# Altium schematic sheet CH340G_PTT.SchDoc
size A3; SheetNumber: 1; SheetTotal: 1
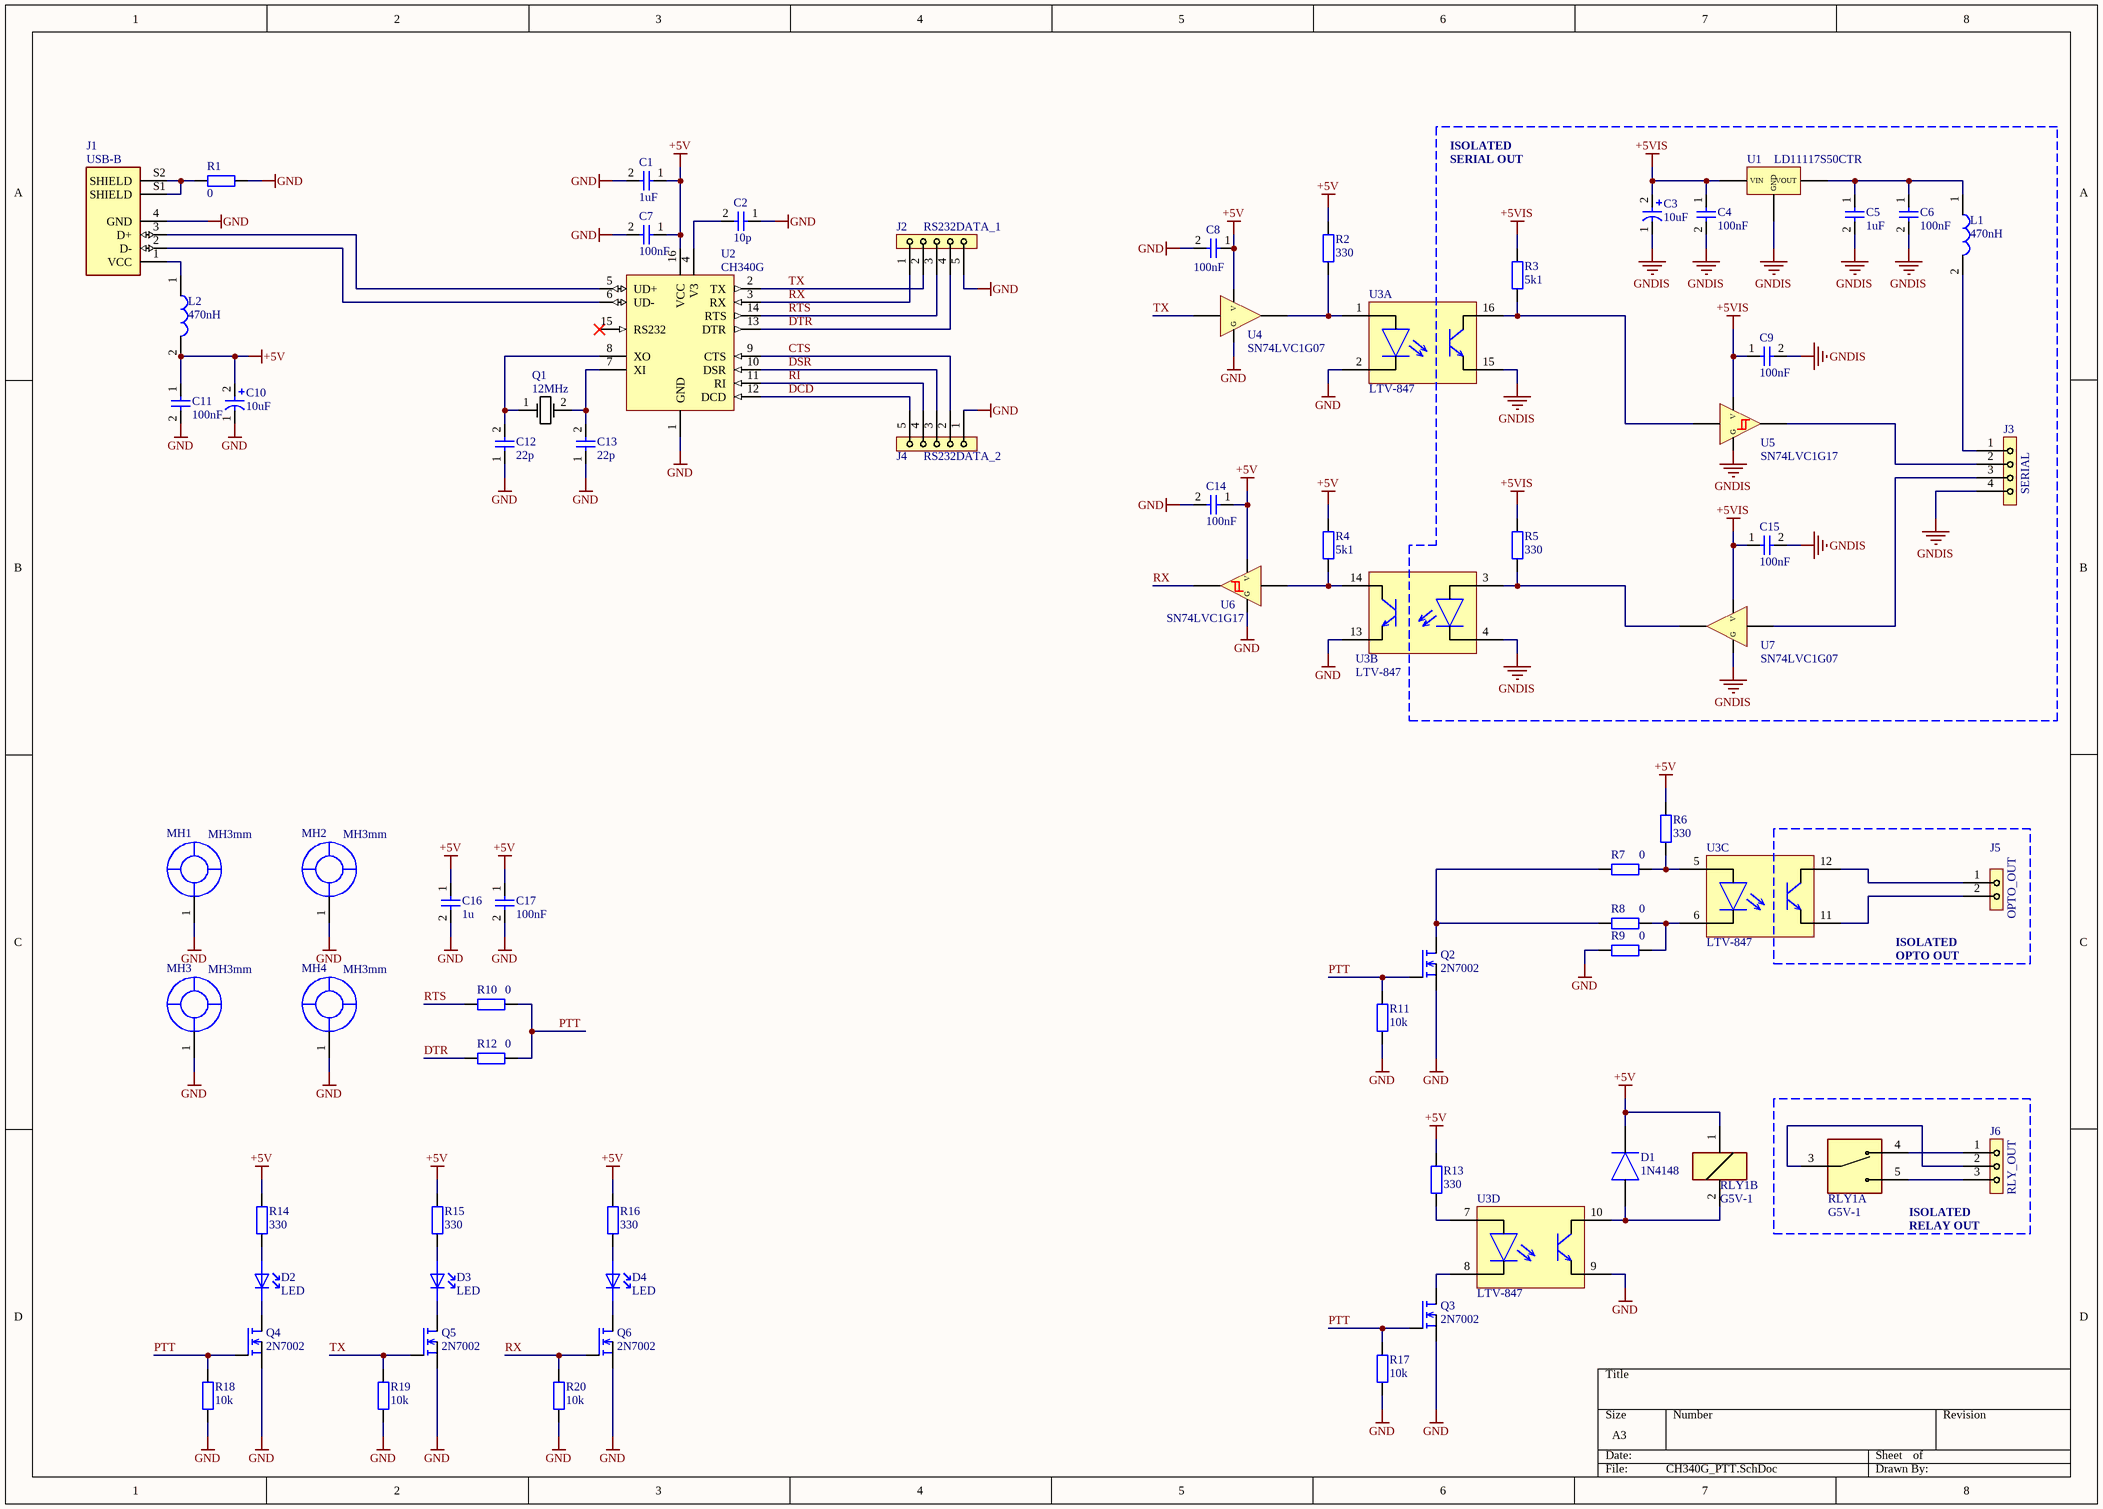
[diagram p0: CH340G_PTT.SchDoc]

## Parts
C1  1uF  [FP-1206-L_3_2_0_2-W_1_6_0-IPC_B]
C2  10p  [FP-1206-L_3_2_0_2-W_1_6_0-IPC_B]
C3  10uF  [CAP_SMD_6.3x7.7mm]
C4  100nF  [FP-1206-L_3_2_0_2-W_1_6_0-IPC_B]
C5  1uF  [FP-1206-L_3_2_0_2-W_1_6_0-IPC_B]
C6  100nF  [FP-1206-L_3_2_0_2-W_1_6_0-IPC_B]
C7  100nF  [FP-1206-L_3_2_0_2-W_1_6_0-IPC_B]
C8  100nF  [FP-1206-L_3_2_0_2-W_1_6_0-IPC_B]
C9  100nF  [FP-1206-L_3_2_0_2-W_1_6_0-IPC_B]
C10  10uF  [CAP_SMD_6.3x7.7mm]
C11  100nF  [FP-1206-L_3_2_0_2-W_1_6_0-IPC_B]
C12  22p  [FP-1206-L_3_2_0_2-W_1_6_0-IPC_B]
C13  22p  [FP-1206-L_3_2_0_2-W_1_6_0-IPC_B]
C14  100nF  [FP-1206-L_3_2_0_2-W_1_6_0-IPC_B]
C15  100nF  [FP-1206-L_3_2_0_2-W_1_6_0-IPC_B]
C16  1u  [FP-1206-L_3_2_0_2-W_1_6_0-IPC_B]
C17  100nF  [FP-1206-L_3_2_0_2-W_1_6_0-IPC_B]
D1  1N4148  [SOD80C]
D2  LED  [LED_3mm]
D3  LED  [LED_3mm]
D4  LED  [LED_3mm]
J1  USB-B  [USB-B]
J2  RS232DATA_1  [PIN_HEADER_1L_5P]
J3  SERIAL  [PIN_HEADER_1L_4P]
J4  RS232DATA_2  [PIN_HEADER_1L_5P]
J5  OPTO_OUT  [PIN_HEADER_1L_2P]
J6  RLY_OUT  [PIN_HEADER_1L_3P]
L1  470nH  [INDC2012X105N]
L2  470nH  [INDC2012X105N]
MH1  MH3mm  [MOUNTING_HOLE_GROUNDED]
MH2  MH3mm  [MOUNTING_HOLE_GROUNDED]
MH3  MH3mm  [MOUNTING_HOLE_GROUNDED]
MH4  MH3mm  [MOUNTING_HOLE_GROUNDED]
Q1  12MHz  [XTAL_SMD]
Q2  2N7002  [SOT23]
Q3  2N7002  [SOT23]
Q4  2N7002  [SOT23]
Q5  2N7002  [SOT23]
Q6  2N7002  [SOT23]
R1  0  [FP-CRCW1206-e3-IPC_B]
R2  Resistance: 330  [FP-CRCW1206-e3-IPC_B]  (hidden comment: Resistor)
R3  Resistance: 5k1  [FP-CRCW1206-e3-IPC_B]  (hidden comment: Resistor)
R4  Resistance: 5k1  [FP-CRCW1206-e3-IPC_B]  (hidden comment: Resistor)
R5  Resistance: 330  [FP-CRCW1206-e3-IPC_B]  (hidden comment: Resistor)
R6  Resistance: 330  [FP-CRCW1206-e3-IPC_B]  (hidden comment: Resistor)
R7  Resistance: 0  [FP-CRCW1206-e3-IPC_B]  (hidden comment: Resistor)
R8  Resistance: 0  [FP-CRCW1206-e3-IPC_B]  (hidden comment: Resistor)
R9  Resistance: 0  [FP-CRCW1206-e3-IPC_B]  (hidden comment: Resistor)
R10  Resistance: 0  [FP-CRCW1206-e3-IPC_B]  (hidden comment: Resistor)
R11  Resistance: 10k  [FP-CRCW1206-e3-IPC_B]  (hidden comment: Resistor)
R12  Resistance: 0  [FP-CRCW1206-e3-IPC_B]  (hidden comment: Resistor)
R13  Resistance: 330  [FP-CRCW1206-e3-IPC_B]  (hidden comment: Resistor)
R14  Resistance: 330  [FP-CRCW1206-e3-IPC_B]  (hidden comment: Resistor)
R15  Resistance: 330  [FP-CRCW1206-e3-IPC_B]  (hidden comment: Resistor)
R16  Resistance: 330  [FP-CRCW1206-e3-IPC_B]  (hidden comment: Resistor)
R17  Resistance: 10k  [FP-CRCW1206-e3-IPC_B]  (hidden comment: Resistor)
R18  Resistance: 10k  [FP-CRCW1206-e3-IPC_B]  (hidden comment: Resistor)
R19  Resistance: 10k  [FP-CRCW1206-e3-IPC_B]  (hidden comment: Resistor)
R20  Resistance: 10k  [FP-CRCW1206-e3-IPC_B]  (hidden comment: Resistor)
RLY1  G5V-1  [OMRON-G5V-1]  (parts A,B of 2)
U1  LD11117S50CTR  [SOT230P700X180-4N]
U2  CH340G  [SOIC16]
U3  LTV-847  [DIP16]  (parts A,B,C,D of 4)
U4  SN74LVC1G07  [SOT95P280X145-5N]
U5  SN74LVC1G17  [SOT95P280X145-5N]
U6  SN74LVC1G17  [SOT95P280X145-5N]
U7  SN74LVC1G07  [SOT95P280X145-5N]

## Nets
+5V: C1.1 C7.1 C8.1 C10.2 C11.1 C14.1 C16.1 C17.1 D1.2(K) L2.2 R2.2 R4.2 R6.2 R13.2 R14.2 R15.2 R16.2 RLY1.1 U2.16(VCC) U4.5(V) U6.5(V)
+5VIS: C3.2 C4.1 C9.1 C15.1 R3.2 R5.1 U1.3(VIN) U5.5(V) U7.5(V)
GND: C1.2 C2.1 C7.2 C8.2 C10.1 C11.2 C12.1 C13.1 C14.2 C16.2 C17.2 J1.4(GND) J2.5 J4.1 MH1.1 MH2.1 MH3.1 MH4.1 Q2.3(S) Q3.3(S) Q4.3(S) Q5.3(S) Q6.3(S) R1.2 R9.1 R11.1 R17.1 R18.1 R19.1 R20.1 U2.1(GND) U3.2(K) U3.9(E) U3.13(E) U4.3(G) U6.3(G)
GNDIS: C3.1 C4.2 C5.2 C6.2 C9.2 C15.2 J3.4 U1.1(GND) U3.4(K) U3.15(E) U5.3(G) U7.3(G)
CTS: J4.2 U2.9(CTS)
DCD: J4.5 U2.12(DCD)
DSR: J4.3 U2.10(DSR)
DTR: J2.4 R12.1 U2.13(DTR)
PTT: Q2.1(G) Q3.1(G) Q4.1(G) R10.2 R11.2 R12.2 R17.2 R18.2
RI: J4.4 U2.11(RI)
RTS: J2.3 R10.1 U2.14(RTS)
RX: J2.1 Q6.1(G) R20.2 U2.3(RX) U6.4(Y)
TX: J2.2 Q5.1(G) R19.2 U2.2(TX) U4.2(A)
NetC2_2: C2.2 U2.4(V3)
NetC5_1: C5.1 C6.1 L1.1 U1.2(VOUT)
NetC12_2: C12.2 Q1.1 U2.8(XO)
NetC13_2: C13.2 Q1.2 U2.7(XI)
NetD1_1: D1.1(A) RLY1.2 U3.10(C)
NetD2_1: D2.1(A) R14.1
NetD2_2: D2.2(K) Q4.2(D)
NetD3_1: D3.1(A) R15.1
NetD3_2: D3.2(K) Q5.2(D)
NetD4_1: D4.1(A) R16.1
NetD4_2: D4.2(K) Q6.2(D)
NetJ1_1: J1.1(VCC) L2.1
NetJ1_2: J1.2(D-) U2.6(UD-)
NetJ1_3: J1.3(D+) U2.5(UD+)
NetJ1_S1: J1.S1(SHIELD) J1.S2(SHIELD) R1.1
NetJ3_1: J3.1 L1.2
NetJ3_2: J3.2 U5.4(Y)
NetJ3_3: J3.3 U7.2(A)
NetJ5_1: J5.1 U3.12(C)
NetJ5_2: J5.2 U3.11(E)
NetJ6_1: J6.1 RLY1.4
NetJ6_2: J6.2 RLY1.3
NetJ6_3: J6.3 RLY1.5
NetQ2_2: Q2.2(D) R7.1 R8.1
NetQ3_2: Q3.2(D) U3.8(K)
NetR2_1: R2.1 U3.1(A) U4.4(Y)
NetR3_1: R3.1 U3.16(C) U5.2(A)
NetR4_1: R4.1 U3.14(C) U6.2(A)
NetR5_2: R5.2 U3.3(A) U7.4(Y)
NetR6_1: R6.1 R7.2 U3.5(A)
NetR8_2: R8.2 R9.2 U3.6(K)
NetR13_1: R13.1 U3.7(A)

Not connected (* = marked no-connect by the designer): U2 15(RS232)*

## Notes on the sheet
- ISOLATED
- SERIAL OUT
- OPTO OUT
- RELAY OUT

## Library data of the parts
C1 C2 C4-C9 C11-C17 = cap_unpol
C3 C10 = cap_pol
D2-D4 = LED_3mm
J1 = USB-B-THT
J2 J4 = PIN_HEADER_1L_5P
J3 = PIN_HEADER_1L_4P
J5 = PIN_HEADER_1L_2P
J6 = PIN_HEADER_1L_3P
L1 L2 = Inductance
MH1-MH4 = MOUNTING_HOLE_3.5mm_1: 3.5mm grounded mounting hole
Q1 = Quartz Crystal
Q2-Q6 = BSS123
R1-R20 = Resistor: EU symbol
  R1: Resistance: 0
RLY1 = RELAY_GENERIC_SPDT